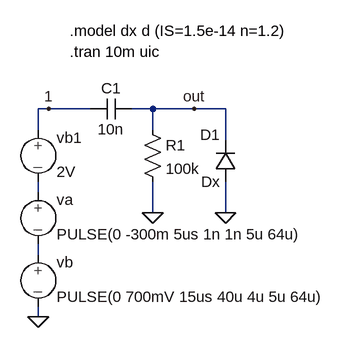
[diagram p0: schematic clamp.asc]
clamp.asc, the LTspice schematic file:
Version 4
SHEET 1 880 680
WIRE 160 64 144 64
WIRE 224 64 160 64
WIRE 320 64 288 64
WIRE 384 64 320 64
WIRE 432 64 384 64
WIRE 144 96 144 64
WIRE 320 96 320 64
WIRE 432 112 432 64
WIRE 144 192 144 176
WIRE 320 224 320 176
WIRE 432 224 432 176
WIRE 144 288 144 272
WIRE 144 384 144 368
FLAG 320 224 0
FLAG 144 384 0
FLAG 432 224 0
FLAG 160 64 1
FLAG 384 64 out
SYMBOL source-V 144 176 R0
WINDOW 123 0 0 Left 2
WINDOW 39 0 0 Left 2
SYMATTR InstName va
SYMATTR Value PULSE(0 -300m 5us 1n 1n 5u 64u)
SYMBOL cap 224 80 R270
WINDOW 0 32 32 VTop 2
WINDOW 3 0 32 VBottom 2
SYMATTR InstName C1
SYMATTR Value 10n
SYMBOL diode 448 176 R180
WINDOW 0 24 72 Left 2
WINDOW 3 24 0 Left 2
SYMATTR InstName D1
SYMATTR Value Dx
SYMBOL res 304 80 R0
SYMATTR InstName R1
SYMATTR Value 100k
SYMBOL source-V 144 272 R0
WINDOW 123 0 0 Left 2
WINDOW 39 0 0 Left 2
SYMATTR InstName vb
SYMATTR Value PULSE(0 700mV 15us 40u 4u 5u 64u)
SYMBOL source-V 144 80 R0
SYMATTR InstName vb1
SYMATTR Value 2V
TEXT 192 -24 Left 2 !.tran 10m uic
TEXT 192 -56 Left 2 !.model dx d (IS=1.5e-14 n=1.2)

The netlist it stands for:
* clamp.asc
va N001 N002 PULSE(0 -300m 5us 1n 1n 5u 64u)
C1 1 out 10n
D1 0 out Dx
R1 out 0 100k
vb N002 0 PULSE(0 700mV 15us 40u 4u 5u 64u)
vb1 1 N001 2V
.model D D
.lib standard.dio
.tran 10m uic
.model dx d (IS=1.5e-14 n=1.2)
.backanno
.end